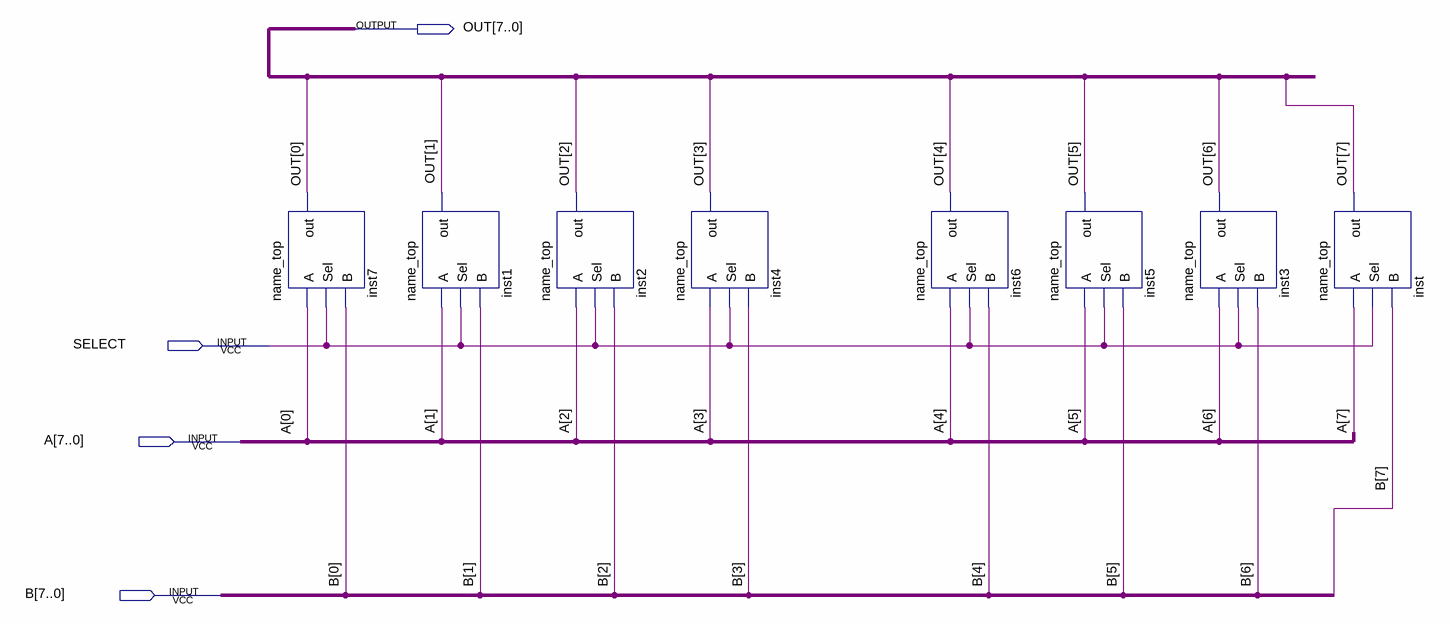
[diagram p0: schematic sheet]
// Quartus schematic name_top_2.bdf as structural Verilog: 8 symbols, 4 pins
module name_top_2 (
  input  SELECT,
  input  [7:0] A,
  input  [7:0] B,
  output [7:0] OUT
);

  name_top inst7 (.A(A[0]), .Sel(SELECT), .B(B[0]), .out(OUT[0]));
  name_top inst1 (.A(A[1]), .Sel(SELECT), .B(B[1]), .out(OUT[1]));
  name_top inst2 (.A(A[2]), .Sel(SELECT), .B(B[2]), .out(OUT[2]));
  name_top inst4 (.A(A[3]), .Sel(SELECT), .B(B[3]), .out(OUT[3]));
  name_top inst6 (.A(A[4]), .Sel(SELECT), .B(B[4]), .out(OUT[4]));
  name_top inst5 (.A(A[5]), .Sel(SELECT), .B(B[5]), .out(OUT[5]));
  name_top inst3 (.A(A[6]), .Sel(SELECT), .B(B[6]), .out(OUT[6]));
  name_top inst (.A(A[7]), .Sel(SELECT), .B(B[7]), .out(OUT[7]));
endmodule
